# Altium schematic sheet pico_1726036.SchDoc
size A3; SheetNumber: 2; SheetTotal: 2
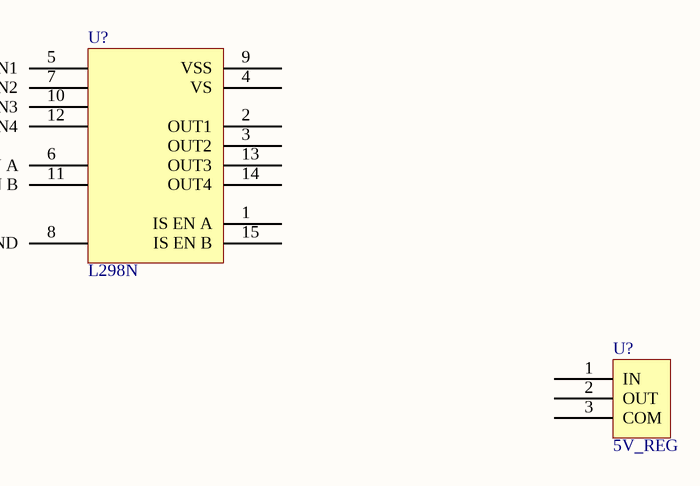
[diagram p0: pico_1726036.SchDoc]

## Parts
(Parts that share a designator on the sheet are numbered #1, #2 ... from top to bottom, then left to right.)
U?#1  L298N  [L298N]
U?#2  5V_REG  [HSOP3-P-2.3]

## Nets

Not connected (* = marked no-connect by the designer): U?#1 1(IS_EN_A) 2(OUT1) 3(OUT2) 4(VS) 5(IN1) 6(EN_A) 7(IN2) 8(GND) 9(VSS) 10(IN3) 11(EN_B) 12(IN4) 13(OUT3) 14(OUT4) 15 (IS_EN_B); U?#2 1(IN) 2(OUT) 3(COM)

## Library data of the parts
U?#2 = TA78M05F_regulator